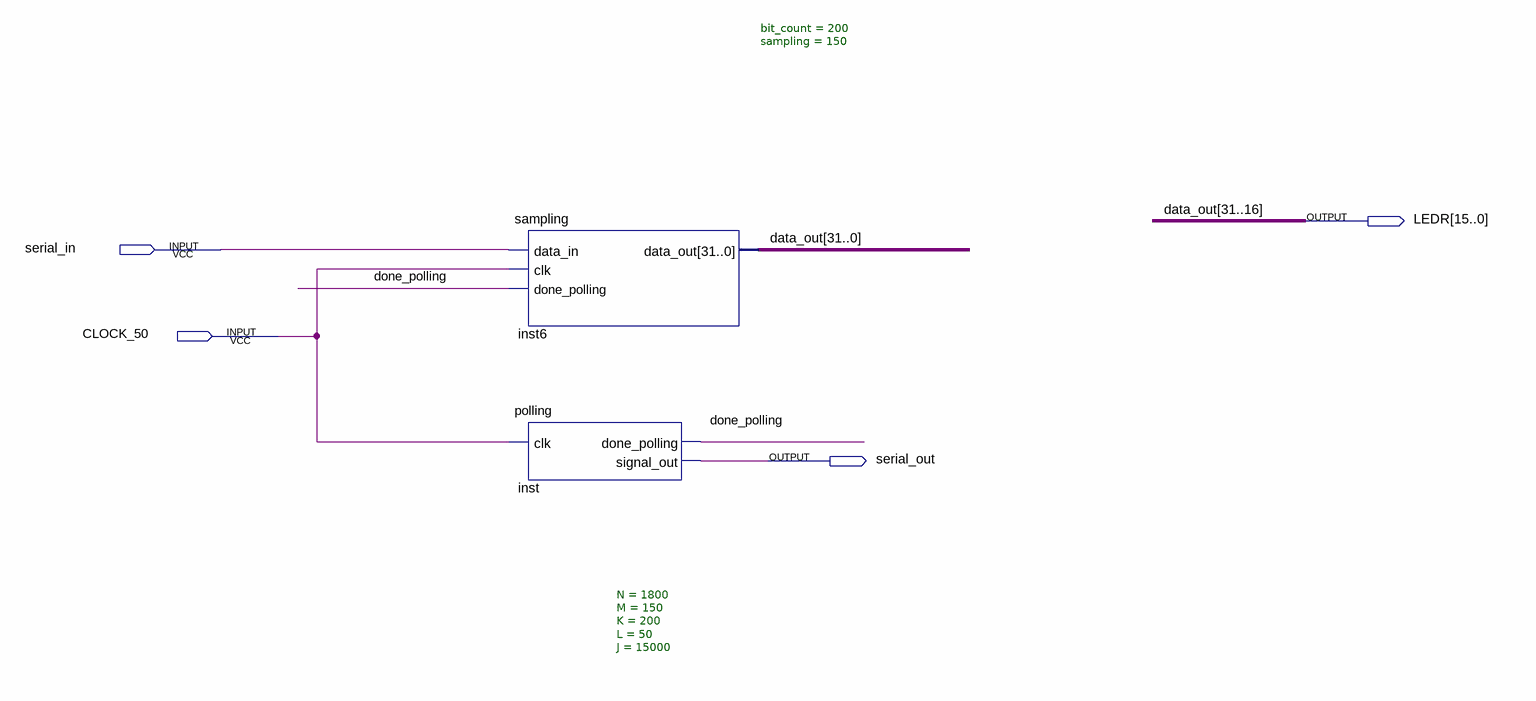
[diagram p0: schematic sheet]
// Quartus schematic n64_driver.bdf as structural Verilog: 2 symbols, 4 pins
module n64_driver (
  input  serial_in,
  input  CLOCK_50,
  output [15:0] LEDR,
  output serial_out
);

  wire done_polling;
  wire [15:0] data_out;

  sampling #(.bit_count(200), .sampling(150)) inst6 (
    .data_in(serial_in), .clk(CLOCK_50), .done_polling(done_polling), .data_out({LEDR, data_out}));
  polling #(.N(1800), .M(150), .K(200), .L(50), .J(15000)) inst (
    .clk(CLOCK_50), .done_polling(done_polling), .signal_out(serial_out));

  // Other names for the same wires on the sheet: data_out[31:16] = LEDR
endmodule
